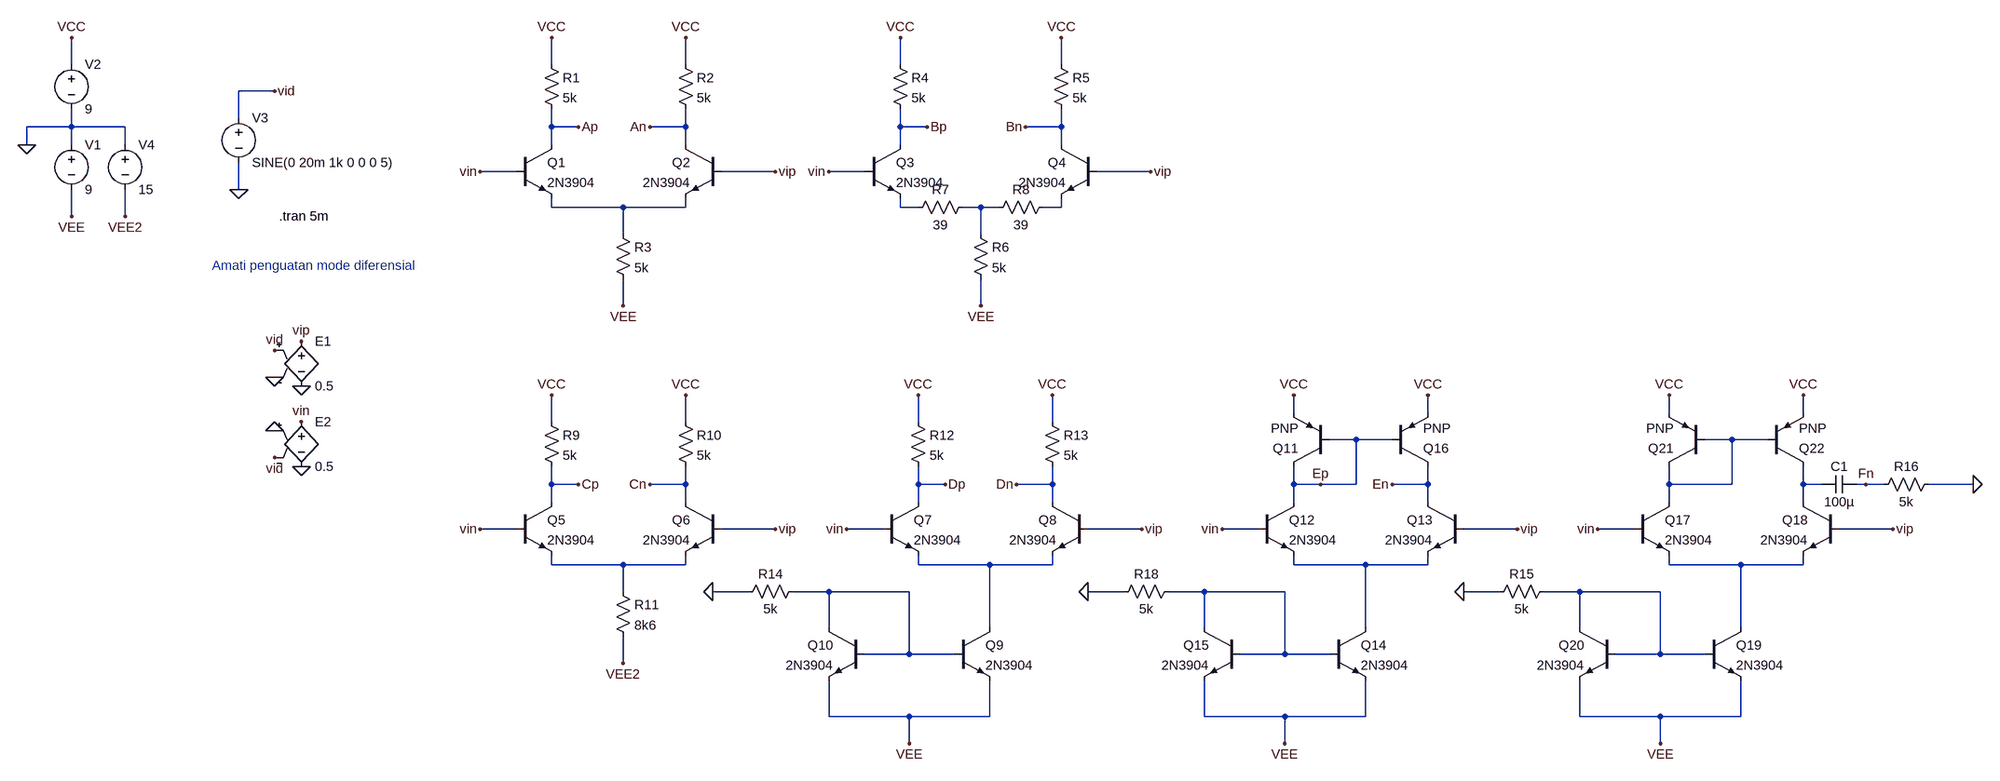
[diagram p0: schematic Perc-01-differentialmode.asc]
Perc-01-differentialmode.asc, the LTspice schematic file:
Version 4
SHEET 1 2964 1272
WIRE -496 -32 -496 -80
WIRE 400 -32 400 -80
WIRE 640 -32 640 -80
WIRE 1024 -32 1024 -80
WIRE 1312 -32 1312 -80
WIRE -96 16 -160 16
WIRE -160 64 -160 16
WIRE -496 80 -496 48
WIRE -496 80 -576 80
WIRE -400 80 -496 80
WIRE 400 80 400 48
WIRE 448 80 400 80
WIRE 640 80 640 48
WIRE 640 80 576 80
WIRE 1024 80 1024 48
WIRE 1072 80 1024 80
WIRE 1312 80 1312 48
WIRE 1312 80 1248 80
WIRE -576 112 -576 80
WIRE -496 112 -496 80
WIRE -400 112 -400 80
WIRE 400 112 400 80
WIRE 640 112 640 80
WIRE 1024 112 1024 80
WIRE 1312 112 1312 80
WIRE 336 160 272 160
WIRE 800 160 704 160
WIRE 960 160 896 160
WIRE 1472 160 1376 160
WIRE -160 192 -160 144
WIRE 400 224 400 208
WIRE 528 224 400 224
WIRE 640 224 640 208
WIRE 640 224 528 224
WIRE 1024 224 1024 208
WIRE 1056 224 1024 224
WIRE 1168 224 1136 224
WIRE 1200 224 1168 224
WIRE 1312 224 1312 208
WIRE 1312 224 1280 224
WIRE -496 240 -496 192
WIRE -400 240 -400 192
WIRE 528 272 528 224
WIRE 1168 272 1168 224
WIRE 528 400 528 352
WIRE 1168 400 1168 352
WIRE 1728 592 1728 560
WIRE 1968 592 1968 560
WIRE 2400 592 2400 560
WIRE 2640 592 2640 560
WIRE 400 608 400 560
WIRE 640 608 640 560
WIRE 1056 608 1056 560
WIRE 1296 608 1296 560
WIRE 1840 640 1792 640
WIRE 1904 640 1840 640
WIRE 2512 640 2464 640
WIRE 2576 640 2512 640
WIRE 400 720 400 688
WIRE 448 720 400 720
WIRE 640 720 640 688
WIRE 640 720 576 720
WIRE 1056 720 1056 688
WIRE 1104 720 1056 720
WIRE 1296 720 1296 688
WIRE 1296 720 1232 720
WIRE 1728 720 1728 688
WIRE 1776 720 1728 720
WIRE 1840 720 1840 640
WIRE 1840 720 1776 720
WIRE 1968 720 1968 688
WIRE 1968 720 1904 720
WIRE 2400 720 2400 688
WIRE 2512 720 2512 640
WIRE 2512 720 2400 720
WIRE 2640 720 2640 688
WIRE 2672 720 2640 720
WIRE 2752 720 2736 720
WIRE 2784 720 2752 720
WIRE 2944 720 2864 720
WIRE 400 752 400 720
WIRE 640 752 640 720
WIRE 1056 752 1056 720
WIRE 1296 752 1296 720
WIRE 1728 752 1728 720
WIRE 1968 752 1968 720
WIRE 2400 752 2400 720
WIRE 2640 752 2640 720
WIRE 336 800 272 800
WIRE 800 800 704 800
WIRE 992 800 928 800
WIRE 1456 800 1360 800
WIRE 1664 800 1600 800
WIRE 2128 800 2032 800
WIRE 2336 800 2272 800
WIRE 2800 800 2704 800
WIRE 400 864 400 848
WIRE 528 864 400 864
WIRE 640 864 640 848
WIRE 640 864 528 864
WIRE 1056 864 1056 848
WIRE 1184 864 1056 864
WIRE 1296 864 1296 848
WIRE 1296 864 1184 864
WIRE 1728 864 1728 848
WIRE 1856 864 1728 864
WIRE 1968 864 1968 848
WIRE 1968 864 1856 864
WIRE 2400 864 2400 848
WIRE 2528 864 2400 864
WIRE 2640 864 2640 848
WIRE 2640 864 2528 864
WIRE 528 912 528 864
WIRE 752 912 688 912
WIRE 896 912 832 912
WIRE 1040 912 896 912
WIRE 1424 912 1360 912
WIRE 1568 912 1504 912
WIRE 1712 912 1568 912
WIRE 2096 912 2032 912
WIRE 2240 912 2176 912
WIRE 2384 912 2240 912
WIRE 896 976 896 912
WIRE 1184 976 1184 864
WIRE 1568 976 1568 912
WIRE 1856 976 1856 864
WIRE 2240 976 2240 912
WIRE 2528 976 2528 864
WIRE 1040 1024 1040 912
WIRE 1040 1024 960 1024
WIRE 1120 1024 1040 1024
WIRE 1712 1024 1712 912
WIRE 1712 1024 1632 1024
WIRE 1792 1024 1712 1024
WIRE 2384 1024 2384 912
WIRE 2384 1024 2304 1024
WIRE 2464 1024 2384 1024
WIRE 528 1040 528 992
WIRE 896 1136 896 1072
WIRE 1040 1136 896 1136
WIRE 1184 1136 1184 1072
WIRE 1184 1136 1040 1136
WIRE 1568 1136 1568 1072
WIRE 1712 1136 1568 1136
WIRE 1856 1136 1856 1072
WIRE 1856 1136 1712 1136
WIRE 2240 1136 2240 1072
WIRE 2384 1136 2240 1136
WIRE 2528 1136 2528 1072
WIRE 2528 1136 2384 1136
WIRE 1040 1184 1040 1136
WIRE 1712 1184 1712 1136
WIRE 2384 1184 2384 1136
FLAG 400 -80 VCC
FLAG 640 -80 VCC
FLAG 528 400 VEE
FLAG 272 160 vin
FLAG 448 80 Ap
FLAG 576 80 An
FLAG -496 -80 VCC
FLAG -496 240 VEE
FLAG -576 112 0
FLAG -160 192 0
FLAG -96 16 vid
FLAG 1024 -80 VCC
FLAG 1312 -80 VCC
FLAG 1168 400 VEE
FLAG 896 160 vin
FLAG 1072 80 Bp
FLAG 1248 80 Bn
FLAG -400 240 VEE2
FLAG 400 560 VCC
FLAG 640 560 VCC
FLAG 528 1040 VEE2
FLAG 272 800 vin
FLAG 448 720 Cp
FLAG 576 720 Cn
FLAG 1056 560 VCC
FLAG 1296 560 VCC
FLAG 928 800 vin
FLAG 1104 720 Dp
FLAG 1232 720 Dn
FLAG 1040 1184 VEE
FLAG 688 912 0
FLAG 1728 560 VCC
FLAG 1968 560 VCC
FLAG 1600 800 vin
FLAG 1776 720 Ep
FLAG 1904 720 En
FLAG 1712 1184 VEE
FLAG 1360 912 0
FLAG 2400 560 VCC
FLAG 2640 560 VCC
FLAG 2272 800 vin
FLAG 2384 1184 VEE
FLAG 2032 912 0
FLAG 2944 720 0
FLAG 2752 720 Fn
FLAG 800 160 vip
FLAG 800 800 vip
FLAG 1456 800 vip
FLAG 2128 800 vip
FLAG 2800 800 vip
FLAG 1472 160 vip
FLAG -48 544 0
FLAG -48 688 0
FLAG -96 480 vid
FLAG -96 672 vid
FLAG -96 624 0
FLAG -96 528 0
FLAG -48 464 vip
FLAG -48 608 vin
SYMBOL npn 336 112 R0
SYMATTR InstName Q1
SYMATTR Value 2N3904
SYMBOL npn 704 112 M0
SYMATTR InstName Q2
SYMATTR Value 2N3904
SYMBOL res 384 -48 R0
SYMATTR InstName R1
SYMATTR Value 5k
SYMBOL res 624 -48 R0
SYMATTR InstName R2
SYMATTR Value 5k
SYMBOL res 512 256 R0
SYMATTR InstName R3
SYMATTR Value 5k
SYMBOL voltage -496 96 R0
WINDOW 123 0 0 Left 0
WINDOW 39 0 0 Left 0
SYMATTR InstName V1
SYMATTR Value 9
SYMBOL voltage -496 -48 R0
WINDOW 123 0 0 Left 0
WINDOW 39 0 0 Left 0
SYMATTR InstName V2
SYMATTR Value 9
SYMBOL voltage -160 48 R0
WINDOW 123 0 0 Left 0
WINDOW 39 0 0 Left 0
SYMATTR InstName V3
SYMATTR Value SINE(0 20m 1k 0 0 0 5)
SYMBOL npn 960 112 R0
SYMATTR InstName Q3
SYMATTR Value 2N3904
SYMBOL npn 1376 112 M0
SYMATTR InstName Q4
SYMATTR Value 2N3904
SYMBOL res 1008 -48 R0
SYMATTR InstName R4
SYMATTR Value 5k
SYMBOL res 1296 -48 R0
SYMATTR InstName R5
SYMATTR Value 5k
SYMBOL res 1152 256 R0
SYMATTR InstName R6
SYMATTR Value 5k
SYMBOL res 1152 208 R90
WINDOW 0 0 56 VBottom 2
WINDOW 3 32 56 VTop 2
SYMATTR InstName R7
SYMATTR Value 39
SYMBOL res 1296 208 R90
WINDOW 0 0 56 VBottom 2
WINDOW 3 32 56 VTop 2
SYMATTR InstName R8
SYMATTR Value 39
SYMBOL voltage -400 96 R0
WINDOW 123 0 0 Left 0
WINDOW 39 0 0 Left 0
SYMATTR InstName V4
SYMATTR Value 15
SYMBOL npn 336 752 R0
SYMATTR InstName Q5
SYMATTR Value 2N3904
SYMBOL npn 704 752 M0
SYMATTR InstName Q6
SYMATTR Value 2N3904
SYMBOL res 384 592 R0
SYMATTR InstName R9
SYMATTR Value 5k
SYMBOL res 624 592 R0
SYMATTR InstName R10
SYMATTR Value 5k
SYMBOL res 512 896 R0
SYMATTR InstName R11
SYMATTR Value 8k6
SYMBOL npn 992 752 R0
SYMATTR InstName Q7
SYMATTR Value 2N3904
SYMBOL npn 1360 752 M0
SYMATTR InstName Q8
SYMATTR Value 2N3904
SYMBOL res 1040 592 R0
SYMATTR InstName R12
SYMATTR Value 5k
SYMBOL res 1280 592 R0
SYMATTR InstName R13
SYMATTR Value 5k
SYMBOL npn 1120 976 R0
SYMATTR InstName Q9
SYMATTR Value 2N3904
SYMBOL npn 960 976 M0
SYMATTR InstName Q10
SYMATTR Value 2N3904
SYMBOL res 848 896 R90
WINDOW 0 0 56 VBottom 2
WINDOW 3 32 56 VTop 2
SYMATTR InstName R14
SYMATTR Value 5k
SYMBOL npn 1664 752 R0
SYMATTR InstName Q12
SYMATTR Value 2N3904
SYMBOL npn 2032 752 M0
SYMATTR InstName Q13
SYMATTR Value 2N3904
SYMBOL npn 1792 976 R0
SYMATTR InstName Q14
SYMATTR Value 2N3904
SYMBOL npn 1632 976 M0
SYMATTR InstName Q15
SYMATTR Value 2N3904
SYMBOL res 1520 896 R90
WINDOW 0 0 56 VBottom 2
WINDOW 3 32 56 VTop 2
SYMATTR InstName R18
SYMATTR Value 5k
SYMBOL pnp 1792 688 R180
SYMATTR InstName Q11
SYMBOL pnp 1904 688 M180
SYMATTR InstName Q16
SYMBOL npn 2336 752 R0
SYMATTR InstName Q17
SYMATTR Value 2N3904
SYMBOL npn 2704 752 M0
SYMATTR InstName Q18
SYMATTR Value 2N3904
SYMBOL npn 2464 976 R0
SYMATTR InstName Q19
SYMATTR Value 2N3904
SYMBOL npn 2304 976 M0
SYMATTR InstName Q20
SYMATTR Value 2N3904
SYMBOL res 2192 896 R90
WINDOW 0 0 56 VBottom 2
WINDOW 3 32 56 VTop 2
SYMATTR InstName R15
SYMATTR Value 5k
SYMBOL pnp 2464 688 R180
SYMATTR InstName Q21
SYMBOL pnp 2576 688 M180
SYMATTR InstName Q22
SYMBOL cap 2736 704 R90
WINDOW 0 0 32 VBottom 2
WINDOW 3 32 32 VTop 2
SYMATTR InstName C1
SYMATTR Value 100µ
SYMBOL res 2880 704 R90
WINDOW 0 0 56 VBottom 2
WINDOW 3 32 56 VTop 2
SYMATTR InstName R16
SYMATTR Value 5k
SYMBOL e -48 448 R0
SYMATTR InstName E1
SYMATTR Value 0.5
SYMBOL e -48 592 R0
SYMATTR InstName E2
SYMATTR Value 0.5
TEXT -88 240 Left 2 !.tran 5m
TEXT -208 328 Left 2 ;Amati penguatan mode diferensial

The netlist it stands for:
* Perc-01-differentialmode.asc
Q1 Ap vin N001 0 2N3904
Q2 An vip N001 0 2N3904
R1 VCC Ap 5k
R2 VCC An 5k
R3 N001 VEE 5k
V1 0 VEE 9
V2 VCC 0 9
V3 vid 0 SINE(0 20m 1k 0 0 0 5)
Q3 Bp vin N002 0 2N3904
Q4 Bn vip N004 0 2N3904
R4 VCC Bp 5k
R5 VCC Bn 5k
R6 N003 VEE 5k
R7 N003 N002 39
R8 N004 N003 39
V4 0 VEE2 15
Q5 Cp vin N007 0 2N3904
Q6 Cn vip N007 0 2N3904
R9 VCC Cp 5k
R10 VCC Cn 5k
R11 N007 VEE2 8k6
Q7 Dp vin N008 0 2N3904
Q8 Dn vip N008 0 2N3904
R12 VCC Dp 5k
R13 VCC Dn 5k
Q9 N008 N011 VEE 0 2N3904
Q10 N011 N011 VEE 0 2N3904
R14 N011 0 5k
Q12 Ep vin N009 0 2N3904
Q13 En vip N009 0 2N3904
Q14 N009 N012 VEE 0 2N3904
Q15 N012 N012 VEE 0 2N3904
R18 N012 0 5k
Q11 Ep Ep VCC 0 PNP
Q16 En Ep VCC 0 PNP
Q17 N005 vin N010 0 2N3904
Q18 N006 vip N010 0 2N3904
Q19 N010 N013 VEE 0 2N3904
Q20 N013 N013 VEE 0 2N3904
R15 N013 0 5k
Q21 N005 N005 VCC 0 PNP
Q22 N006 N005 VCC 0 PNP
C1 Fn N006 100µ
R16 0 Fn 5k
E1 vip 0 vid 0 0.5
E2 vin 0 0 vid 0.5
.model NPN NPN
.model PNP PNP
.lib standard.bjt
.tran 5m
* Amati penguatan mode diferensial
.backanno
.end